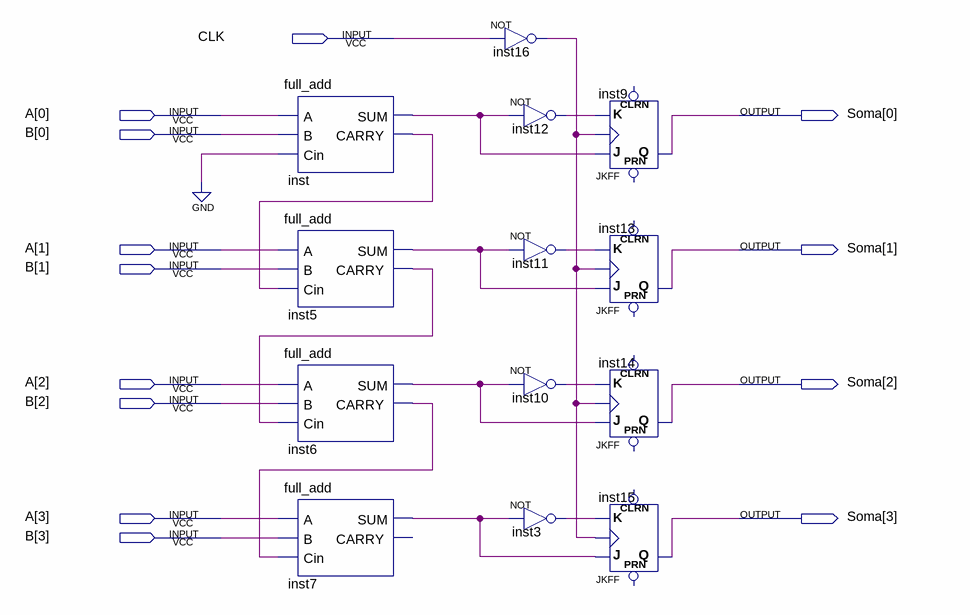
[diagram p0: schematic sheet]
// Quartus schematic add4-sincrono.bdf as structural Verilog: 13 symbols, 13 pins
module \add4-sincrono  (
  input  CLK,
  input  [3:0] A,
  input  [3:0] B,
  output [3:0] Soma
);

  wire inst3_out, inst5_carry, inst5_sum, inst6_carry, inst6_sum, inst7_sum, inst10_out, inst11_out,
       inst12_out, inst16_out, inst_carry, inst_sum;

  full_add inst (.A(A[0]), .B(B[0]), .Cin(1'b0), .SUM(inst_sum), .CARRY(inst_carry));
  full_add inst5 (.A(A[1]), .B(B[1]), .Cin(inst_carry), .SUM(inst5_sum), .CARRY(inst5_carry));
  full_add inst6 (.A(A[2]), .B(B[2]), .Cin(inst5_carry), .SUM(inst6_sum), .CARRY(inst6_carry));
  full_add inst7 (.A(A[3]), .B(B[3]), .Cin(inst6_carry), .SUM(inst7_sum));  // open: CARRY
  not inst16 (inst16_out, CLK);
  not inst12 (inst12_out, inst_sum);
  not inst11 (inst11_out, inst5_sum);
  not inst10 (inst10_out, inst6_sum);
  not inst3 (inst3_out, inst7_sum);
  JKFF inst9 (.K(inst12_out), .J(inst_sum), .CLK(inst16_out), .Q(Soma[0]));  // open: PRN, CLRN
  JKFF inst13 (.K(inst11_out), .J(inst5_sum), .CLK(inst16_out), .Q(Soma[1]));  // open: PRN, CLRN
  JKFF inst14 (.K(inst10_out), .J(inst6_sum), .CLK(inst16_out), .Q(Soma[2]));  // open: PRN, CLRN
  JKFF inst15 (.K(inst3_out), .J(inst7_sum), .CLK(inst16_out), .Q(Soma[3]));  // open: PRN, CLRN
endmodule
